# EAGLE design FanMultiplier (EAGLE 6.5.0)
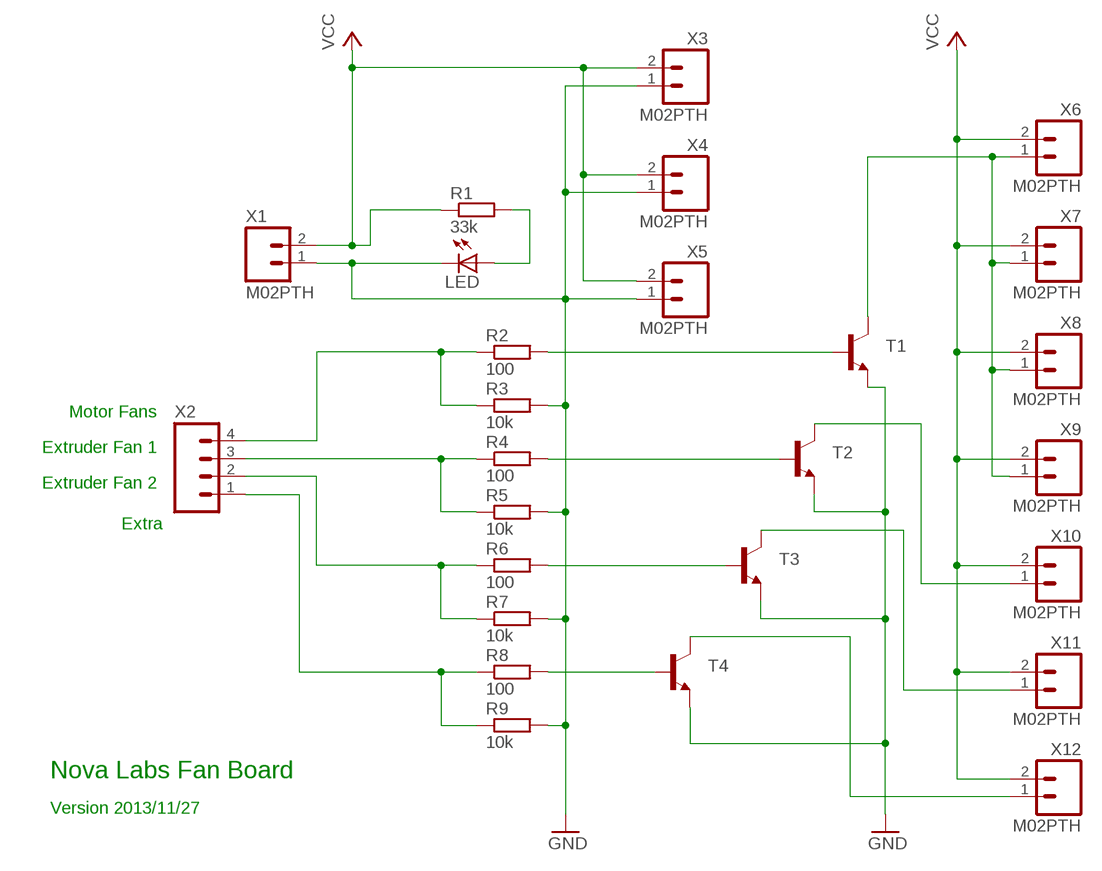
[diagram p0: schematic, sheet 1]

## Parts
LED  LED3MM  [LED3MM]
R1  33k  R-EU_0207/7  [0207/7]
R2  100  R-EU_0207/7  [0207/7]
R3  10k  R-EU_0207/7  [0207/7]
R4  100  R-EU_0207/7  [0207/7]
R5  10k  R-EU_0207/7  [0207/7]
R6  100  R-EU_0207/7  [0207/7]
R7  10k  R-EU_0207/7  [0207/7]
R8  100  R-EU_0207/7  [0207/7]
R9  10k  R-EU_0207/7  [0207/7]
T1  TRANSISTOR_NPNTO92  [TO-92]
T2  TRANSISTOR_NPNTO92  [TO-92]
T3  TRANSISTOR_NPNTO92  [TO-92]
T4  TRANSISTOR_NPNTO92  [TO-92]
X1  M02PTH  [1X02]
X2  M04PTH  [1X04]
X3  M02PTH  [1X02]
X4  M02PTH  [1X02]
X5  M02PTH  [1X02]
X6  M02PTH  [1X02]
X7  M02PTH  [1X02]
X8  M02PTH  [1X02]
X9  M02PTH  [1X02]
X10  M02PTH  [1X02]
X11  M02PTH  [1X02]
X12  M02PTH  [1X02]

## Nets
GND: LED.K(C) R3.2 R5.2 R7.2 R9.2 T1.1(E) T2.1(E) T3.1(E) T4.1(E) X1.1 X3.1 X4.1 X5.1
N$1: R2.2 T1.2(B)
N$2: R4.2 T2.2(B)
N$3: R6.2 T3.2(B)
N$4: LED.A R1.2
N$5: R2.1 R3.1 X2.4
N$6: R4.1 R5.1 X2.3
N$7: R6.1 R7.1 X2.2
N$8: R8.1 R9.1 X2.1
N$11: R8.2 T4.2(B)
N$12: T4.3(C) X12.1
N$14: T1.3(C) X6.1 X7.1 X8.1 X9.1
N$16: T2.3(C) X10.1
N$17: T3.3(C) X11.1
VCC: R1.1 X1.2 X3.2 X4.2 X5.2 X6.2 X7.2 X8.2 X9.2 X10.2 X11.2 X12.2

## Notes on the sheet
- Motor Fans
- Extruder Fan 1
- Extruder Fan 2
- Extra
- Nova Labs Fan Board
- Version 2013/11/27

## Library data of the parts
LED = SparkFun-LED:LED: LEDs Standard schematic elements and footprints for 5mm, 3mm, 1206, and 0603 sized LEDs. 5mm - Spark Fun Electronics SKU : COM-00529 (and others)
R1-R9 = rcl:R-EU_: RESISTOR, European symbol
T1-T4 = SparkFun-DiscreteSemi:TRANSISTOR_NPN: Generic NPN BJT MMBT2222A - TRANS-08049 (SOT-23, 1A 40V) MPSA42 - TRANS-09116 (SOT-23, 500mA 300V) MMBT5088LT1G - TRANS-11160 (SOT-23, 50 mA 30V)
X1 X3-X12 = SparkFun-Connectors:M02: Standard 2-pin 0.1" header. Use with - straight break away headers ( PRT-00116) - right angle break away headers (PRT-00553) - swiss pins (PRT-00743) - machine pins (PRT-00117) - female headers (PRT-00115) Molex polarized connector foot print use with: PRT-08233 with associated crimp pins and housings. 2.54_SCREWTERM for use with PRT-10571. 3.5mm Screw Terminal footprints for PRT-08084 5mm Screw Terminal footprints for use with PRT-08433
X2 = SparkFun-Connectors:M04: Header 4 Standard 4-pin 0.1" header. Use with straight break away headers (SKU : PRT-00116), right angle break away headers (PRT-00553), swiss pins (PRT-00743), machine pins (PRT-00117), and female headers (PRT-00115). Molex polarized connector foot print use with SKU : PRT-08231 with associated crimp pins and housings. 1MM SMD Version SKU: PRT-10208

## Board
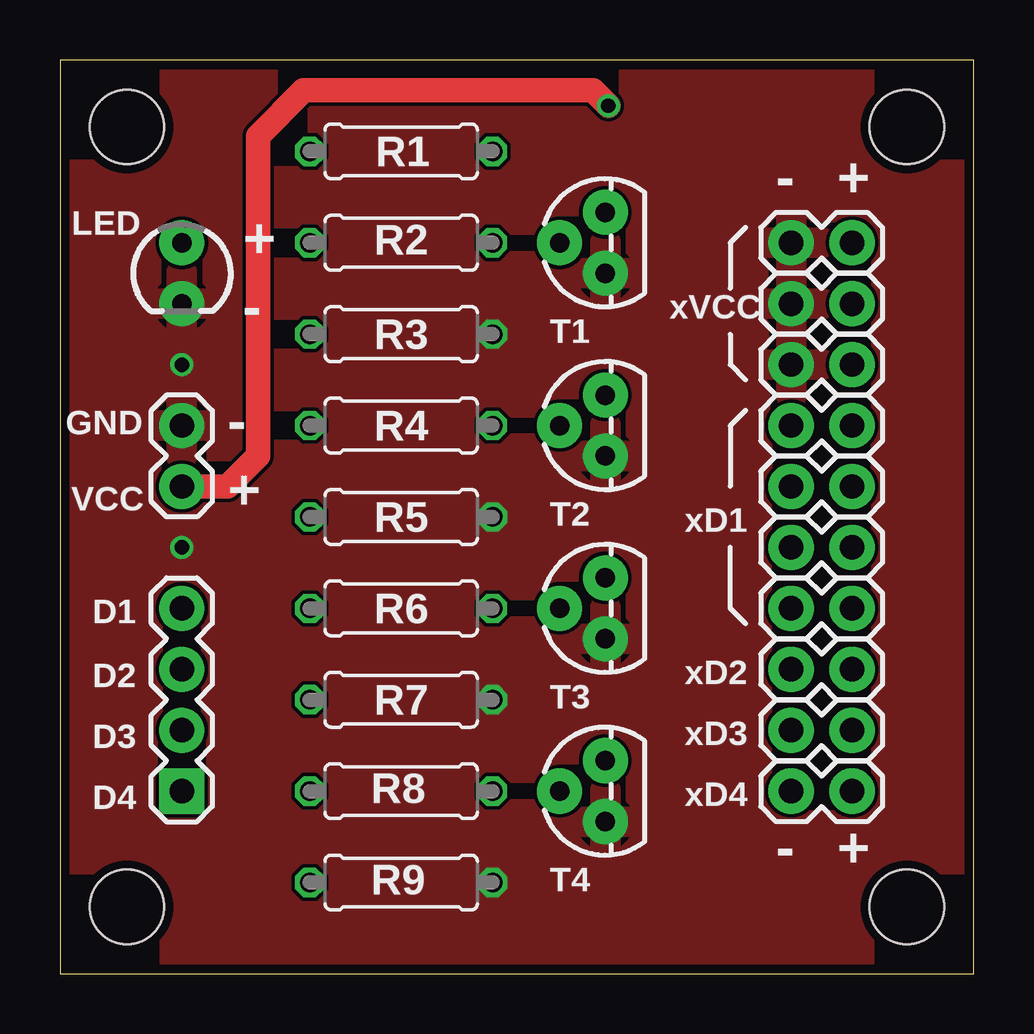
[diagram p1: board, top side]
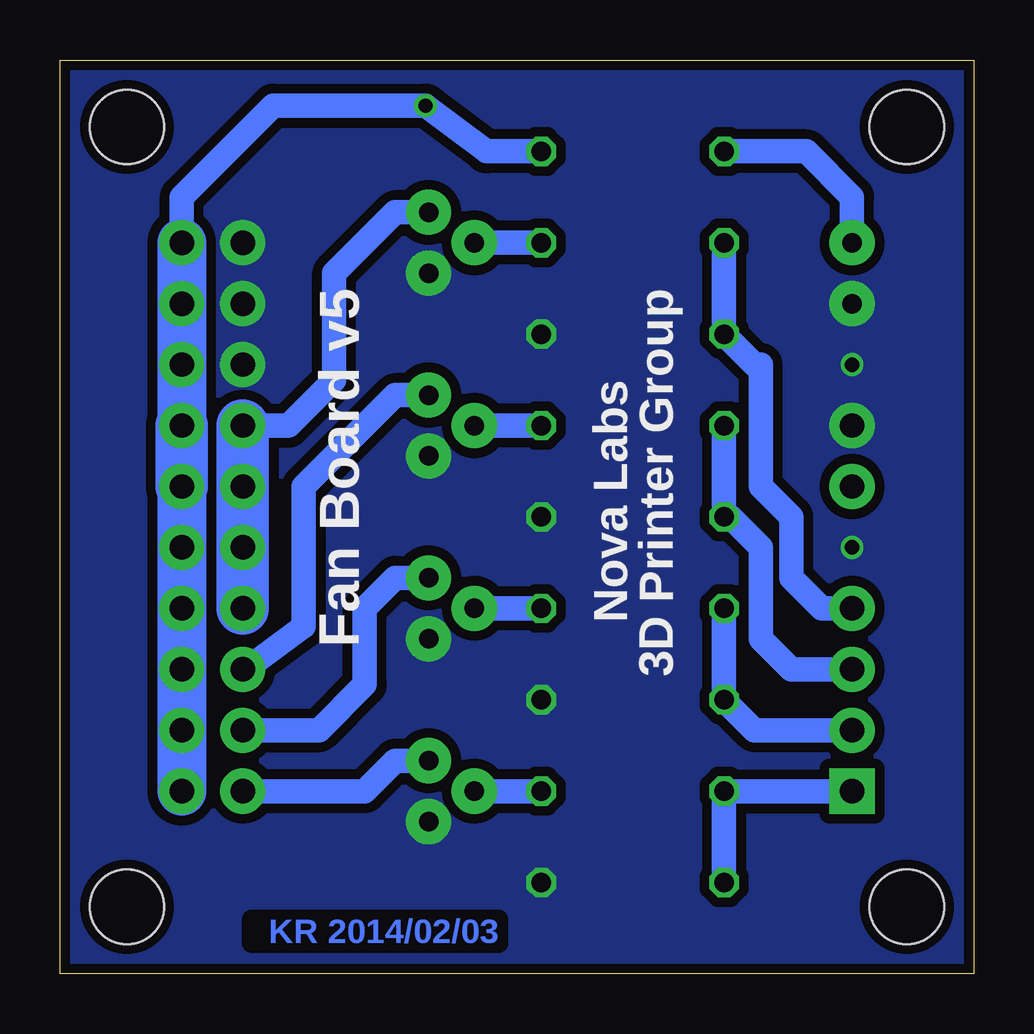
[diagram p2: board, bottom side, seen from below]

Size 38.1 x 38.1 mm. Coordinates in mm from the lower left corner, seen from the top.
Outline: 0,0 38.1,0 38.1,38.1 0,38.1 0,0
Copper layers (1*16): Top 0.0356mm / dielectric 1.5011mm / Bottom 0.0356mm
Design rules "LaenPCBOrder": minimum track width 6mil, minimum drill 13mil, track to track 6mil, track to pad 6mil, pad to pad 6mil, via to via 6mil, smd to smd 6mil, copper to edge 15mil, drill to drill 6mil, minimum pad ring 7mil, minimum via ring 7mil, stop-mask expansion 3mil, vias tented up to drill 0mil, thermal gap 10mil
Holes 3.1 mm at 2.79,2.79 2.79,35.31 35.31,2.79 35.31,35.31

### Footprints (pad centres in the part's own frame; a part is rotated, then mirrored left to right if it is on the bottom)
LED3MM = drill 0.813 pad 1.88: A -1.27,0; K 1.27,0
0207/7 = drill 0.813 octagon: 1 -3.81,0; 2 3.81,0
TO-92 = drill 0.813 pad 1.88: 1 -1.27,0; 2 0,1.905; 3 1.27,0
1X02 = drill 1.016 pad 1.88: 1 0,0; 2 2.54,0
1X04 = drill 1.016 pad 1.88 square: 1 0,0 | drill 1.016 pad 1.88: 2 2.54,0; 3 5.08,0; 4 7.62,0

### Placement (x,y rotation side)
LED  5.08,29.21 270 top
R1  14.22,34.29 180 top
R2  14.22,30.48 0 top
R3  14.22,26.67 0 top
R4  14.22,22.86 0 top
R5  14.22,19.05 0 top
R6  14.22,15.24 0 top
R7  14.22,11.43 0 top
R8  14.22,7.62 0 top
R9  14.22,3.81 0 top
T1  22.73,30.48 90 top
T2  22.73,22.86 90 top
T3  22.73,15.24 90 top
T4  22.73,7.62 90 top
X1  5.08,22.86 270 top
X2  5.08,7.62 90 top
X3  30.48,30.48 0 top
X4  30.48,27.94 0 top
X5  30.48,25.4 0 top
X6  30.48,22.86 0 top
X7  30.48,20.32 0 top
X8  30.48,17.78 0 top
X9  30.48,15.24 0 top
X10  30.48,12.7 0 top
X11  30.48,10.16 0 top
X12  30.48,7.62 0 top

### Tracks (layer width: path | path; a pad name or v marks a point on that pad's centre or on a via)
GND  (via drill 0.6)
  other vias: 5.08,25.4 5.08,17.78
  pour Bottom (isolate 0.406, no thermals): -0.03,-0.25 38.1,-0.25 38.1,38.1 0,38.1
  pour Top: 0,0 0,38.1 38.1,38.1 38.1,0
N$1
  Bottom 1.016: R2.2 T1.2
N$2
  Bottom 1.016: R4.2 T2.2
N$3
  Bottom 1.016: R6.2 T3.2
N$4
  Bottom 1.016: LED.A 5.08,32.38 6.99,34.29 R1.2
N$5
  Bottom 1.016: R2.1 R3.1 9.14,25.4 8.89,25.4 8.89,20.32 7.62,19.05 7.62,16.51 6.35,15.24 X2.4
N$6
  Bottom 1.016: R4.1 R5.1 10.16,19.05 8.89,17.78 8.89,13.97 7.62,12.7 X2.3
N$7
  Bottom 1.016: R6.1 R7.1 9.14,10.16 X2.2
N$8
  Bottom 1.016: R9.1 R8.1 X2.1
N$11
  Bottom 1.016: R8.2 T4.2
N$12
  Bottom 1.016: T4.3 24.13,8.89 25.4,7.62 X12.1
N$14
  Bottom 1.016: T1.3 24.13,31.75 26.67,29.21 26.67,24.77 28.57,22.86 X6.1
  Bottom 2.184: X6.1 X7.1 X8.1 X9.1
N$16
  Bottom 1.016: T2.3 24.13,24.13 27.94,20.32 27.94,14.48 30.35,12.7 X10.1
N$17
  Bottom 1.016: T3.3 24.13,16.51 25.4,15.24 25.4,12.06 27.3,10.16 X11.1
VCC  (via drill 0.6)
  Top 1.016: X1.2 6.99,20.32 8.26,21.59 8.26,34.92 10.16,36.83 22.23,36.83 v22.86,36.2
  Bottom 1.016: X3.2 33.02,32.38 29.21,36.2 v22.86,36.2 20.32,34.29 R1.1
  Bottom 2.032: X7.2 X8.2 X9.2 X10.2 X11.2 X12.2 | X3.2 X4.2 X5.2 X6.2
  Bottom 2.184: X6.2 X7.2

### Text on the board
Bottom: KR 2014/02/03
tPlace: xVCC | GND | VCC | xD1 | D1 | D2 | xD2 | D3 | xD3 | D4 | xD4
bPlace: 3D Printer Group | Fan Board v5 | Nova Labs
tNames: - | + | + | - | - | + | - | +
200bmp: /Users/krad/Documents/My Pictures/NovaLabs/nova-labs_logo_black.bmp